# Altium schematic sheet MCPS Power IGBT 030520.SchDoc
size A3
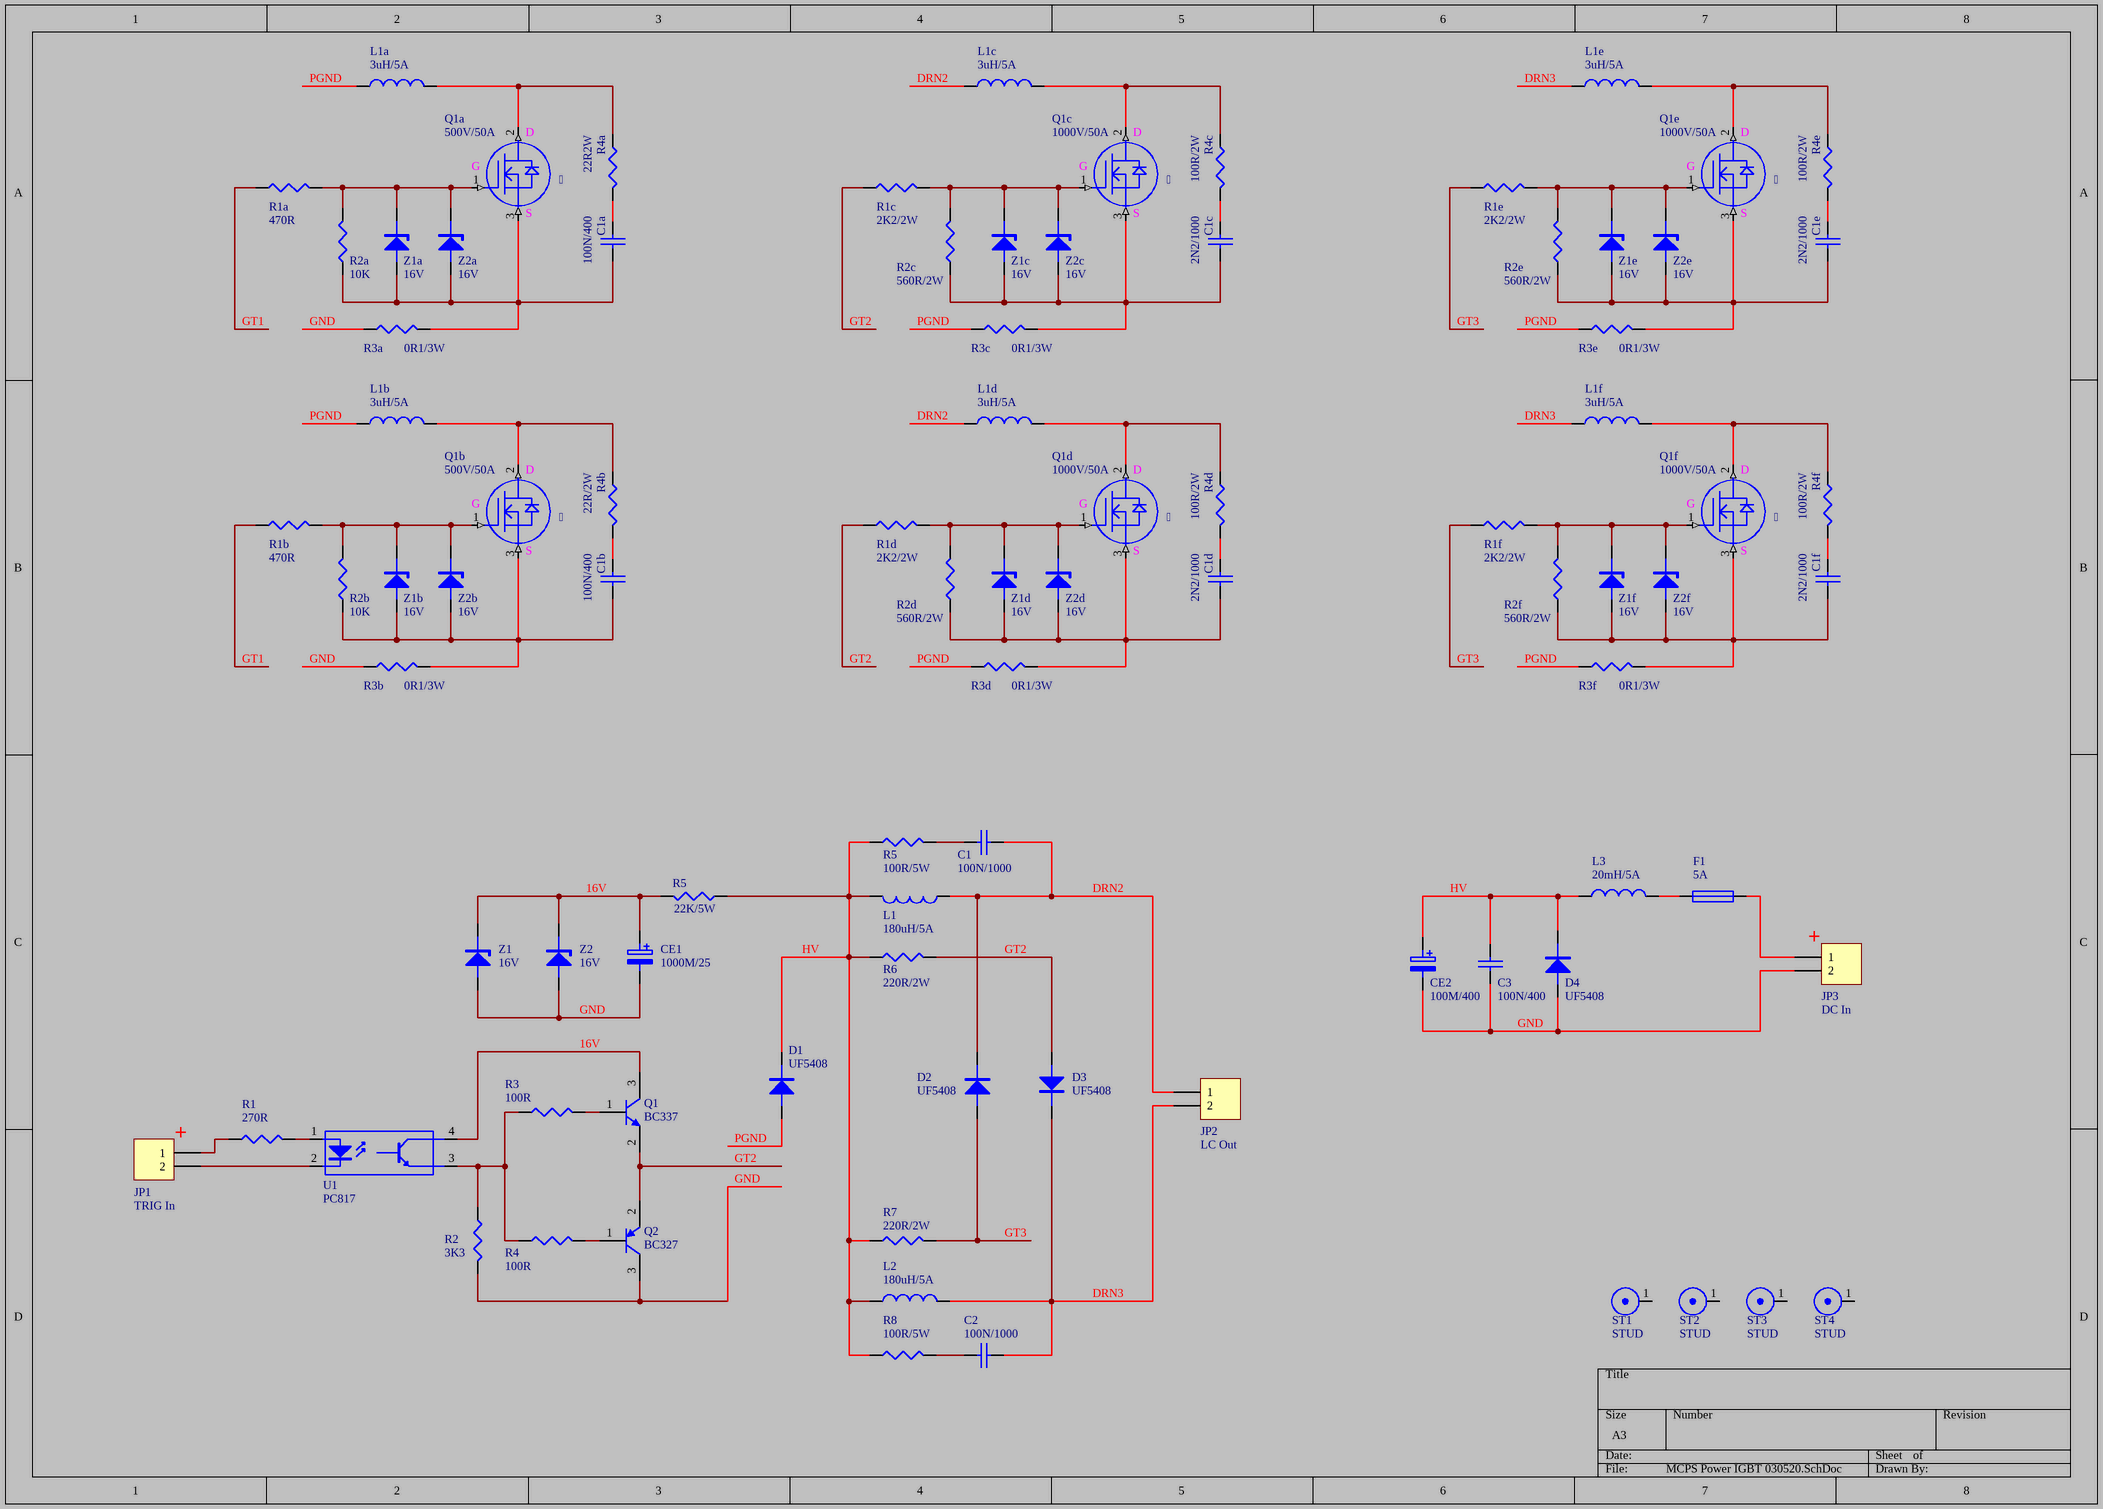
[diagram p0: MCPS Power IGBT 030520.SchDoc]

## Parts
(Parts that share a designator on the sheet are numbered #1, #2 ... from top to bottom, then left to right.)
C1  100N/1000  [C4P]
C1a  100N/400  [C2P]
C1b  100N/400  [C2P]
C1c  2N2/1000  [C2P]
C1d  2N2/1000  [C2P]
C1e  2N2/1000  [C2P]
C1f  2N2/1000  [C2P]
C2  100N/1000  [C4P]
C3  100N/400  [C4P]
CE1  1000M/25  [cap2p12]
CE2  100M/400  [CAP3P5]
D1  UF5408  [D54]
D2  UF5408  [D54]
D3  UF5408  [D54]
D4  UF5408  [D54]
F1  5A  [FL]
JP1  TRIG In  [DSIP2]
JP2  LC Out  [DG55X2]
JP3  DC In  [DG55X2]
L1  180uH/5A  [Inductor3916]
L1a  3uH/5A  [Inductor3916]
L1b  3uH/5A  [Inductor3916]
L1c  3uH/5A  [Inductor3916]
L1d  3uH/5A  [Inductor3916]
L1e  3uH/5A  [Inductor3916]
L1f  3uH/5A  [Inductor3916]
L2  180uH/5A  [Inductor3916]
L3  20mH/5A  [Inductor3916]
Q1  BC337  [CBE-BC546]
Q1a    [TO247-MOSPIN]
Q1b    [TO247-MOSPIN]
Q1c    [TO247-MOSPIN]
Q1d    [TO247-MOSPIN]
Q1e    [TO247-MOSPIN]
Q1f    [TO247-MOSPIN]
Q2  BC327  [CBE-BC546]
R1  270R  [W1/4]
R1a  470R  [W1]
R1b  470R  [W1]
R1c  2K2/2W  [W1]
R1d  2K2/2W  [W1]
R1e  2K2/2W  [W1]
R1f  2K2/2W  [W1]
R2  3K3  [W1/4]
R2a  10K  [W1/4]
R2b  10K  [W1/4]
R2c  560R/2W  [W1/4]
R2d  560R/2W  [W1/4]
R2e  560R/2W  [W1/4]
R2f  560R/2W  [W1/4]
R3  100R  [W1/4]
R3a  0R1/3W  [W1]
R3b  0R1/3W  [W1]
R3c  0R1/3W  [W1]
R3d  0R1/3W  [W1]
R3e  0R1/3W  [W1]
R3f  0R1/3W  [W1]
R4  100R  [W1/4]
R4a  22R2W  [W1]
R4b  22R/2W  [W1]
R4c  100R/2W  [W1]
R4d  100R/2W  [W1]
R4e  100R/2W  [W1]
R4f  100R/2W  [W1]
R5#1  100R/5W  [W2]
R5#2  22K/5W  [W2]
R6  220R/2W  [W2]
R7  220R/2W  [W2]
R8  100R/5W  [W2]
ST1  STUD  [CORNER]
ST2  STUD  [CORNER]
ST3  STUD  [CORNER]
ST4  STUD  [CORNER]
U1  PC817  [DIP4]
Z1  16V  [D5P]
Z1a  16V  [D5P]
Z1b  16V  [D5P]
Z1c  16V  [D5P]
Z1d  16V  [D5P]
Z1e  16V  [D5P]
Z1f  16V  [D5P]
Z2  16V  [D5P]
Z2a  16V  [D5P]
Z2b  16V  [D5P]
Z2c  16V  [D5P]
Z2d  16V  [D5P]
Z2e  16V  [D5P]
Z2f  16V  [D5P]

## Nets
16V: CE1.1 Q1.3(C) R5#2.2 U1.4(C) Z1.2(K) Z2.2(K)
DRN2: C1.2 D2.2(K) JP2.1 L1.2 L1c.1 L1d.1
DRN3: C2.2 D3.2(K) JP2.2 L1e.1 L1f.1 L2.2
GND: C3.2 CE1.2 CE2.2 D4.1(A) JP3.2 Q2.3(C) R2.2 R3a.1 R3b.1 Z1.1(A) Z2.1(A)
GT1: R1a.1 R1b.1
GT2: D3.1(A) Q1.2(E) Q2.2(B) R1c.1 R1d.1 R6.2
GT3: D2.1(A) R1e.1 R1f.1 R7.2
HV: C3.1 CE2.1 D1.2(K) D4.2(K) L1.1 L2.1 L3.1 R5#1.1 R5#2.1 R6.1 R7.1 R8.1
PGND: D1.1(A) L1a.1 L1b.1 R3c.1 R3d.1 R3e.1 R3f.1
NetC1_1: C1.1 R5#1.2
NetC1a_1: C1a.1 R4a.2
NetC1a_2: C1a.2 Q1a.3(S) R2a.1 R3a.2 Z1a.1(A) Z2a.1(A)
NetC1b_1: C1b.1 R4b.2
NetC1b_2: C1b.2 Q1b.3(S) R2b.1 R3b.2 Z1b.1(A) Z2b.1(A)
NetC1c_1: C1c.1 R4c.2
NetC1c_2: C1c.2 Q1c.3(S) R2c.1 R3c.2 Z1c.1(A) Z2c.1(A)
NetC1d_1: C1d.1 R4d.2
NetC1d_2: C1d.2 Q1d.3(S) R2d.1 R3d.2 Z1d.1(A) Z2d.1(A)
NetC1e_1: C1e.1 R4e.2
NetC1e_2: C1e.2 Q1e.3(S) R2e.1 R3e.2 Z1e.1(A) Z2e.1(A)
NetC1f_1: C1f.1 R4f.2
NetC1f_2: C1f.2 Q1f.3(S) R2f.1 R3f.2 Z1f.1(A) Z2f.1(A)
NetC2_1: C2.1 R8.2
NetF1_1: F1.1 L3.2
NetF1_2: F1.2 JP3.1
NetJP1_1: JP1.1 R1.1
NetJP1_2: JP1.2 U1.2(K)
NetL1a_2: L1a.2 Q1a.2(D) R4a.1
NetL1b_2: L1b.2 Q1b.2(D) R4b.1
NetL1c_2: L1c.2 Q1c.2(D) R4c.1
NetL1d_2: L1d.2 Q1d.2(D) R4d.1
NetL1e_2: L1e.2 Q1e.2(D) R4e.1
NetL1f_2: L1f.2 Q1f.2(D) R4f.1
NetQ1_1: Q1.1(B) R3.2
NetQ1a_1: Q1a.1(G) R1a.2 R2a.2 Z1a.2(K) Z2a.2(K)
NetQ1b_1: Q1b.1(G) R1b.2 R2b.2 Z1b.2(K) Z2b.2(K)
NetQ1c_1: Q1c.1(G) R1c.2 R2c.2 Z1c.2(K) Z2c.2(K)
NetQ1d_1: Q1d.1(G) R1d.2 R2d.2 Z1d.2(K) Z2d.2(K)
NetQ1e_1: Q1e.1(G) R1e.2 R2e.2 Z1e.2(K) Z2e.2(K)
NetQ1f_1: Q1f.1(G) R1f.2 R2f.2 Z1f.2(K) Z2f.2(K)
NetQ2_1: Q2.1(E) R4.2
NetR1_2: R1.2 U1.1(A)
NetR2_1: R2.1 R3.1 R4.1 U1.3(E)

Not connected (* = marked no-connect by the designer): ST1 1; ST2 1; ST3 1; ST4 1

## Notes on the sheet
- (near Q1a) 500V/50A
- (near Q1a) G
- (near Q1a) D
- (near Q1c) 1000V/50A
- (near Q1c) G
- (near Q1c) D
- (near Q1e) 1000V/50A
- (near Q1e) G
- (near Q1e) D
- (near Q1a) S
- (near Q1c) S
- (near Q1e) S
- (near Q1b) 500V/50A
- (near Q1b) G
- (near Q1b) D
- (near Q1d) 1000V/50A
- (near Q1d) G
- (near Q1d) D
- (near Q1f) 1000V/50A
- (near Q1f) G
- (near Q1f) D
- (near Q1b) S
- (near Q1d) S
- (near Q1f) S
- (near JP3) +
- (near JP1) +

## Library data of the parts
C1 C1a C1b C1c C1d C1e C1f C2 C3 = C
CE1 CE2 = E
D1-D4 = D
  D1 D2 D4: D4P: *
F1 = FUSE1
JP1-JP3 = Header 2: Header, 2-Pin; LatestRevisionDate: 17-Jul-2002; LatestRevisionNote: Re-released for DXP Platform.; Publisher: Altium Limited
L1 L1a L1b L1c L1d L1e L1f L2 L3 = INDUCTOR
Q1 = BC546
Q1a Q1b Q1c Q1d Q1e Q1f = MOSFET N
Q2 = M6: PNP; Published: 8-Jun-2000; LatestRevisionDate: 15-Jan-2003; LatestRevisionNote: PCB Footprint 'BCY-W3/D4.7' replaced; DatasheetVersion: 1997; PackageVersion: Sep-1998; PackageReference: TO-92A; Publisher: Altium Limited; PackageDescription: TO, Flat Index; 3 In-Line, Axial Leads; Body Dia. 4.5mm; Leads 0.51 x 0.48 mm (max)
R1 R1a R1b R1c R1d R1e R1f R2 R2a R2b R2c R2d R2e R2f R3 R3a R3b R3c R3d R3e R3f R4 R4a R4b R4c R4d R4e R4f R5#1 R5#2 R6-R8 = R
U1 = OPTODIP4
Z1 Z1a Z1b Z1c Z1d Z1e Z1f Z2 Z2a Z2b Z2c Z2d Z2e Z2f = DZ